# EAGLE design AFM_Power_board (EAGLE 9.6.2)
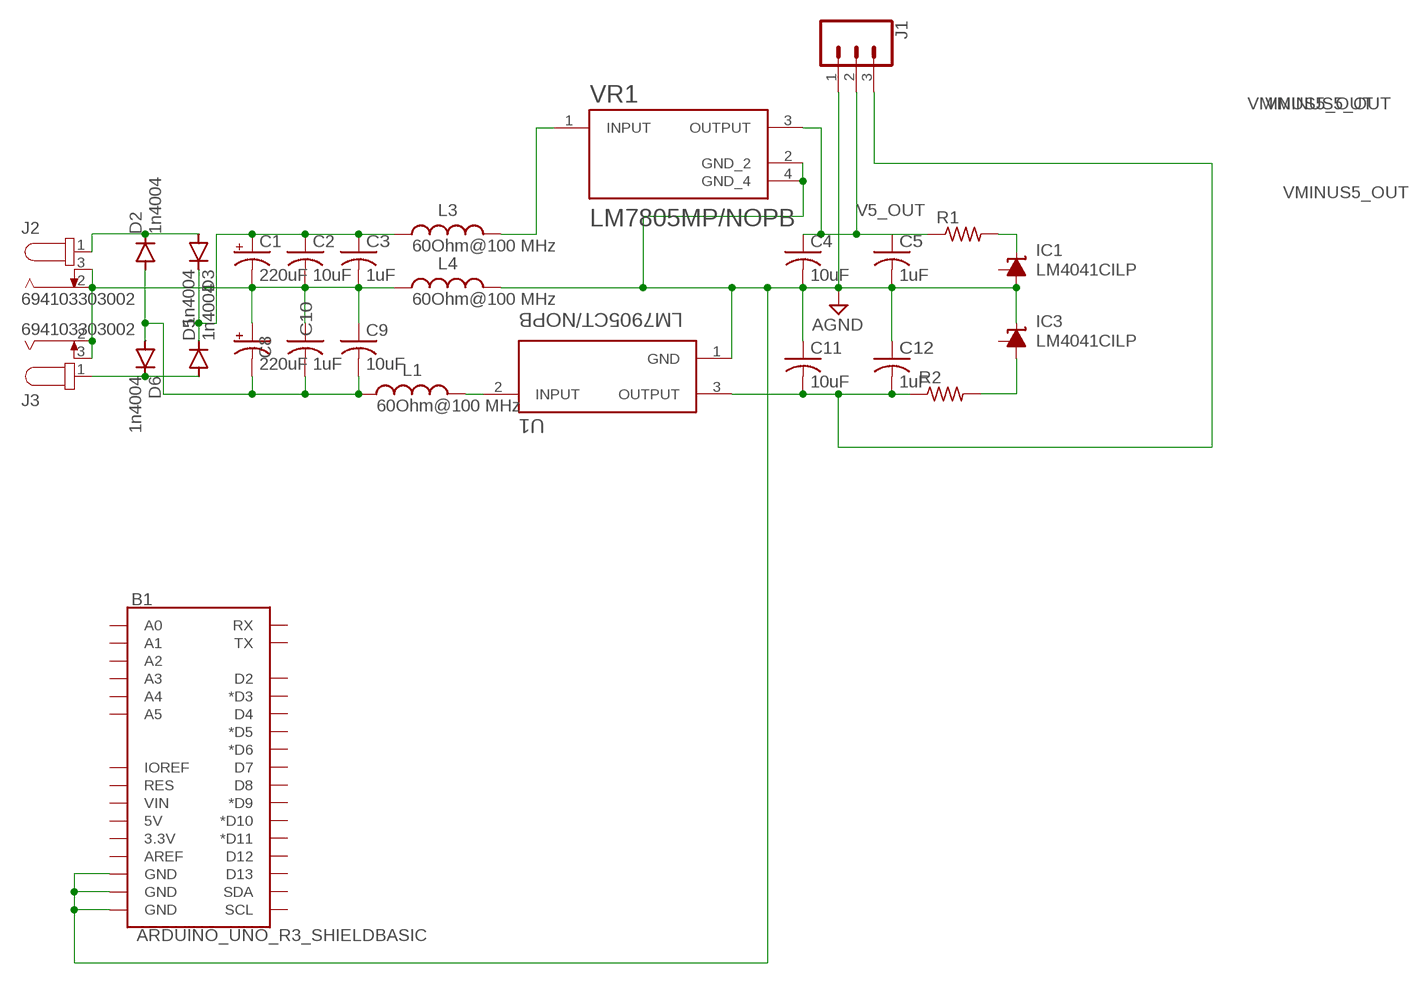
[diagram p0: schematic, sheet 1]

## Parts
B1  ARDUINO_UNO_R3_SHIELDBASIC  [UNO_R3_SHIELD]
C1  220uF  CAPACITOR-PE5-8.5  [E5-8,5]
C2  10uF  C-US050-024X044  [C050-024X044]
C3  1uF  C-US050-024X044  [C050-024X044]
C4  10uF  C-US050-024X044  [C050-024X044]
C5  1uF  C-US050-024X044  [C050-024X044]
C8  220uF  CAPACITOR-PE5-8.5  [E5-8,5]
C9  10uF  C-US050-024X044  [C050-024X044]
C10  1uF  C-US050-024X044  [C050-024X044]
C11  10uF  C-US050-024X044  [C050-024X044]
C12  1uF  C-US050-024X044  [C050-024X044]
D2  1n4004  DIODE-SOD123  [SOD123]
D3  1n4004  DIODE-SOD123  [SOD123]
D5  1n4004  DIODE-SOD123  [SOD123]
D6  1n4004  DIODE-SOD123  [SOD123]
IC1  LM4041CILP  [LP_O-PBCY-W3]
IC3  LM4041CILP  [LP_O-PBCY-W3]
J1  CONN_03LONGPADS  [1X03_LONGPADS]
J2  694103303002  [694103303002]
J3  694103303002  [694103303002]
L1  60Ohm@100 MHz  WE-CBF_0603_74279267_WB_HS  [WE-CBF_0603_W2.2]
L3  60Ohm@100 MHz  WE-CBF_0603_74279267_WB_HS  [WE-CBF_0603_W2.2]
L4  60Ohm@100 MHz  WE-CBF_0603_74279267_WB_HS  [WE-CBF_0603_W2.2]
R1  R-US_0204/5  [0204/5]
R2  R-US_0204/5  [0204/5]
U1  LM7905CT/NOPB  [TO254P1016X4575X1955-3]
VR1  LM7805MP/NOPB  [VREG_LM7805MP/NOPB]

## Nets
AGND: B1.GND@0(GND) B1.GND@1(GND) B1.GND@2(GND) C4.2 C5.2 C11.1 C12.1 IC1.3(A) IC3.2(C) J1.1 L4.2 U1.1(GND) VR1.2(GND_2) VR1.4(GND_4)
GROUND: C1.- C2.2 C3.2 C8.+ C9.1 C10.1 J2.2 J2.3 J3.2 J3.3 L4.1
N$1: L3.2 VR1.1(INPUT)
N$2: L1.2 U1.2(INPUT)
N$4: IC1.2(C) R1.2
N$8: IC3.3(A) R2.2
N$9: D5.A D6.C J3.1
N$10: C8.- C9.2 C10.2 D2.A D6.A L1.1
N$11: C1.+ C2.1 C3.1 D3.C D5.C L3.1
POWERP: D2.C D3.A J2.1
V5_OUT: C4.1 C5.1 J1.2 R1.1 VR1.3(OUTPUT)
VMINUS5_OUT: C11.2 C12.2 J1.3 R2.1 U1.3(OUTPUT)
Unconnected: B1.3.3V B1.5V B1.A0 B1.A1 B1.A2 B1.A3 B1.A4 B1.A5 B1.AREF B1.D2 B1.D3(*D3) B1.D4 B1.D5(*D5) B1.D6(*D6) B1.D7 B1.D8 B1.D9(*D9) B1.D10(*D10) B1.D11(*D11) B1.D12 B1.D13 B1.IOREF B1.RES B1.RX B1.SCL B1.SDA B1.TX B1.VIN IC1.1(FB) IC3.1(FB)

## Library data of the parts
B1 = SparkFun-Boards:ARDUINO_UNO_R3_SHIELD: Arduino R3 Shield Footprint Shield form compatible with the Arduino Uno R3. SparkFun Products: MG2639 Cellular Shield <https://www.sparkfun.com/products/13120> MIDI Shield <https://www.sparkfun.com/products/12898> R3 Stackable Headers Kit <https://www.sparkfun.com/products/11417>
C1 C8 = BeagleBone_Blue_R3:CAPACITOR-P: POLARIZED CAPACITOR, American symbol
C2-C5 C9-C12 = BeagleBone_Black_Wireless:C-US: CAPACITOR, American symbol
D2 D3 D5 D6 = diode:DIODE-: DIODE
IC1 IC3 = texas:LM4041*I: PRECISION MICROPOWER SHUNT VOLTAGE REFERENCE Adjustable Output Source: http://focus.ti.com/lit/ds/slcs146e/slcs146e.pdf; MPN: LM4041CILP; OC_FARNELL: 1673945; OC_NEWARK: 50M8856
J1 = SparkFun-Connectors:CONN_03: Multi connection point. Often used as Generic Header-pin footprint for 0.1 inch spaced/style header connections On any of the 0.1 inch spaced packages, you can populate with these: Break Away Headers - Straight <https://www.sparkfun.com/products/116> (PRT-00116) Break Away Male Headers - Right Angle <https://www.sparkfun.com/products/553> (PRT-00553) Female Headers <https://www.sparkfun.com/products/115> (PRT-00115) Break Away Headers - Machine Pin <https://www.sparkfun.com/products/117> (PRT-00117) Break Away Female Headers - Swiss Machine Pin <https://www.sparkfun.com/products/743> (PRT-00743) Stackable Header - 3 Pin (Female, 0.1") <https://www.sparkfun.com/products/13875> (PRT-13875) For SCREWTERMINALS and SPRING TERMINALS visit here: Screw Terimnals on SparkFun.com <https://www.sparkfun.com/search/results?term=Screw+Terminals> (5mm/3.5mm/2.54mm spacing) This device is also useful as a general connection point to wire up your design to another part of your project. Our various solder wires solder well into these plated through hole pads. Hook-Up Wire - Assortment (Stranded, 22 AWG) <https://www.sparkfun.com/products/11375> (PRT-11375) Hook-Up Wire - Assortment (Solid Core, 22 AWG) <https://www.sparkfun.com/products/11367> (PRT-11367) View the entire wire category on our website here <https://www.sparkfun.com/categories/141> Special notes: Molex polarized connector foot print use with SKU : PRT-08232 with associated crimp pins and housings.
J2 J3 = DC Power Jacks:694103303002: CONN PWR JACK 1.05X3.5MM SOLDER Manufacturer's datasheet <https://katalog.we-online.de/em/datasheet/6941xx303002.pdf>; CREATED_BY: PCBLayout.com; DIGIKEY_PART_NUMBER: 732-5925-ND; MANUFACTURER: Wurth Electronics Inc.; MPN: 694103303002
L1 L3 L4 = Wurth_EMC Components_WE-CBF:WE-CBF_0603: WE-CBF SMD EMI Suppression Ferrite Bead Characteristics Reliable Ni-Sn electrodes High rated current up to 6 A Operating temperature: –55 ºC to +125 ºC Applications Perfect as data lined filter and for uncoupling of distribution voltage Package name and Variant abbreviation: Package: Wide Band /High Speed: W=Width= 2.2 High Current: W=Width= 2.6 Variant abbreviation: WB = Wide Band HS=High Speed HC=High Current <https://www.we-online.com/catalog/media/o14753v209%20Family_WE-CBF.jpg> Details see: www.we-online.com/katalog/WE-CBF <www.we-online.com/catalog/WE-CBF/?utm_source=eagle_model&utm_medium=description_link&utm_campaign=eisos_eagle> Updated by Ella Wu 2022-11-02 2022(C) Wurth Elektronik; DATASHEET-URL: https://www.we-online.com/redexpert/spec/74279267?ae; IR2: 2000mA; MOUNT: SMT; PART-NUMBER: 74279267; RDC-MAX: 0.3Ohm; TYPE: High Speed; Z-MAX: 110Ohm@650 MHz
R1 R2 = BeagleBone_Black_Wireless:R-US_: RESISTOR, American symbol
U1 = LM7905CT_NOPB:LM7905CT/NOPB: Check availability <https://pricing.snapeda.com/parts/LM7905CT/NOPB/Texas%20Instruments/view-part?ref=eda>; AVAILABILITY: In Stock; CHECK_PRICES: https://www.snapeda.com/parts/LM7905CT/NOPB/Texas+Instruments/view-part/?ref=eda; DESCRIPTION: 1.5-A, negative linear voltage regulator; MF: Texas Instruments; MP: LM7905CT/NOPB; PACKAGE: TO-220-3 Texas Instruments; PRICE: None; PURCHASE-URL: https://www.snapeda.com/api/url_track_click_mouser/?unipart_id=6864&manufacturer=Texas Instruments&part_name=LM7905CT/NOPB&search_term=None; SNAPEDA_LINK: https://www.snapeda.com/parts/LM7905CT/NOPB/Texas+Instruments/view-part/?ref=snap
VR1 = LM7805MP_NOPB:LM7805MP/NOPB: 1.5-A, 30-V, linear voltage regulator 4-SOT-223 0 to 125 Check availability <https://pricing.snapeda.com/parts/LM7805MP/NOPB/Texas%20Instruments/view-part?ref=eda>; AVAILABILITY: In Stock; CHECK_PRICES: https://www.snapeda.com/parts/LM7805MP/NOPB/Texas+Instruments/view-part/?ref=eda; DESCRIPTION: 1.5-A, 30-V, linear voltage regulator; MF: Texas Instruments; MP: LM7805MP/NOPB; PACKAGE: SOT-223-4 Texas Instruments; PRICE: None; PURCHASE-URL: https://www.snapeda.com/api/url_track_click_mouser/?unipart_id=545076&manufacturer=Texas Instruments&part_name=LM7805MP/NOPB&search_term=lm7805; SNAPEDA_LINK: https://www.snapeda.com/parts/LM7805MP/NOPB/Texas+Instruments/view-part/?ref=snap

## Board
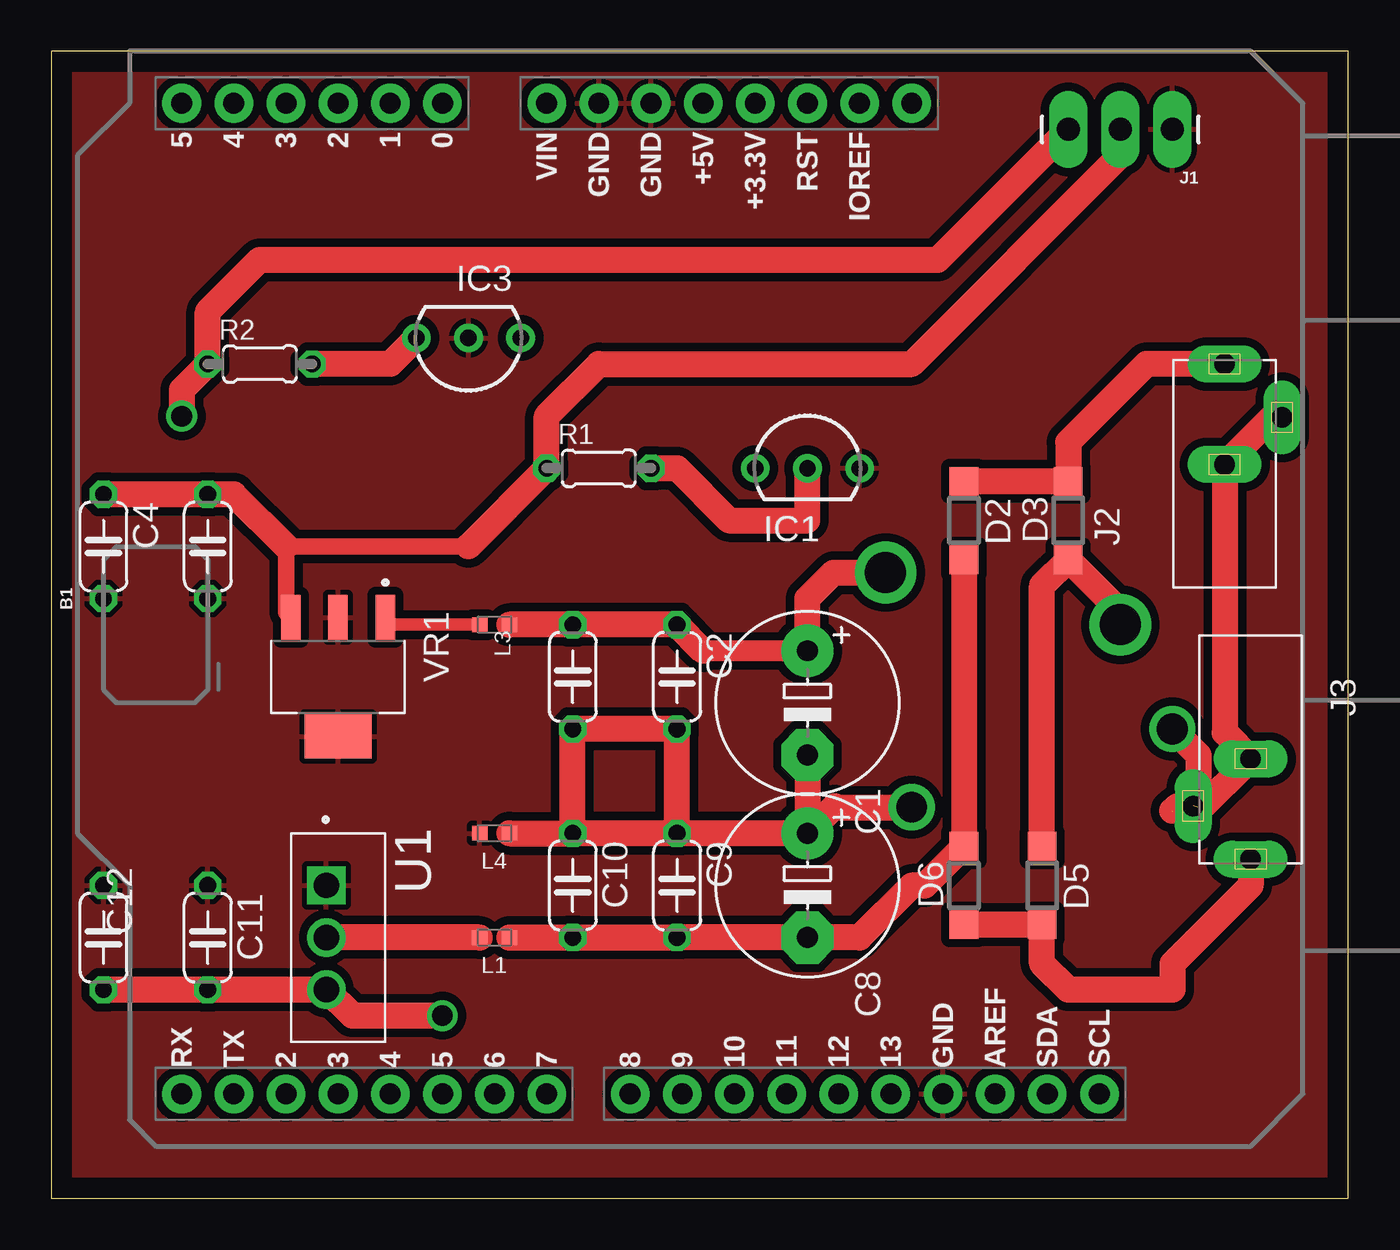
[diagram p1: board, top side]
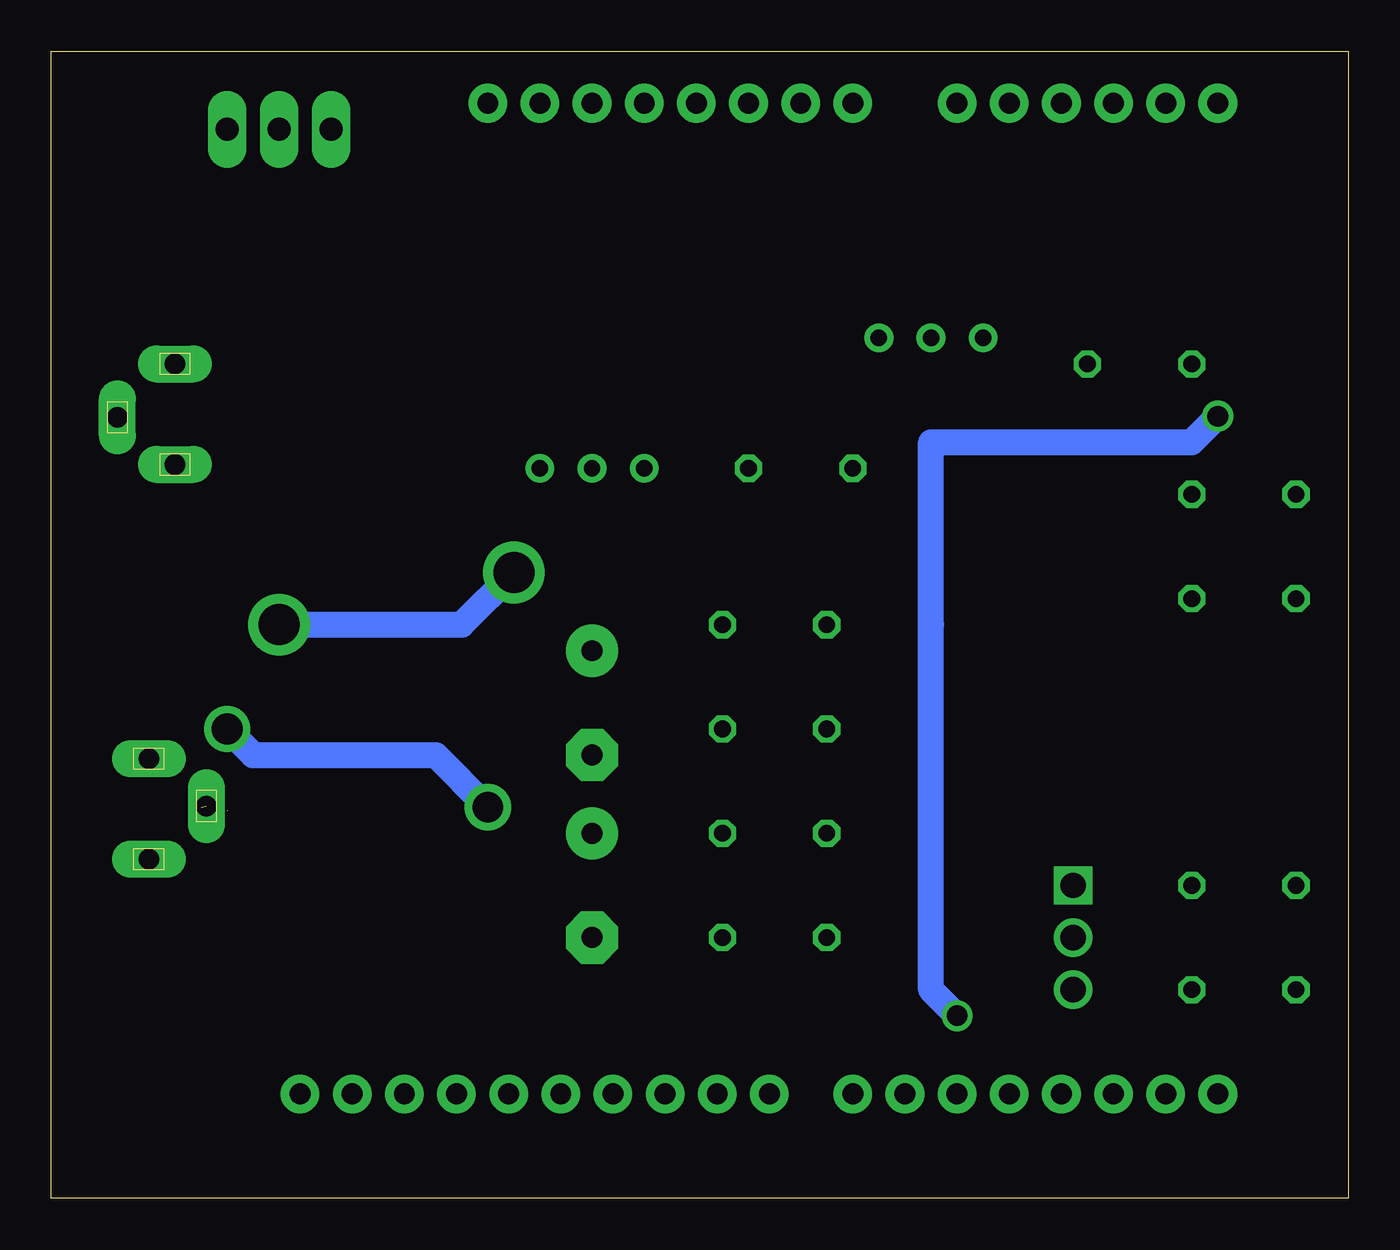
[diagram p2: board, bottom side, seen from below]

Size 63.17 x 55.87 mm. Coordinates in mm from the lower left corner, seen from the top.
Outline: 0,0 63.17,0 63.17,55.87 0,55.87 0,0
Copper layers (1*16): Top 0.035mm / dielectric 1.5mm / Bottom 0.035mm
Design rules "default": minimum track width 6mil, minimum drill 0.35mm, track to track 6mil, track to pad 6mil, pad to pad 6mil, via to via 6mil, smd to smd 6mil, copper to edge 40mil, drill to drill 6mil, minimum pad ring 10mil, minimum via ring 8mil, stop-mask expansion 4mil, vias tented up to drill 0mil, thermal gap 10mil

### Footprints (pad centres in the part's own frame; a part is rotated, then mirrored left to right if it is on the bottom)
UNO_R3_SHIELD = drill 1.016 pad 1.88: 3.3V 24.13,-2.54; 5V 24.13,0; A0 24.13,12.7; A1 24.13,15.24; A2 24.13,17.78; A3 24.13,20.32; A4 24.13,22.86; A5 24.13,25.4; AREF -24.13,-14.224; D2 -24.13,20.32; D3 -24.13,17.78; D4 -24.13,15.24; D5 -24.13,12.7; D6 -24.13,10.16; D7 -24.13,7.62; D8 -24.13,3.556; D9 -24.13,1.016; D10 -24.13,-1.524; D11 -24.13,-4.064; D12 -24.13,-6.604; D13 -24.13,-9.144; GND@0 24.13,2.54; GND@1 24.13,5.08; GND@2 -24.13,-11.684; IOREF 24.13,-7.62; NC 24.13,-10.16; RES 24.13,-5.08; RX -24.13,25.4; SCL -24.13,-19.304; SDA -24.13,-16.764; TX -24.13,22.86; VIN 24.13,7.62
E5-8,5 = drill 1.016 pad 2.54: + -2.54,0 | drill 1.016 pad 2.54 octagon: - 2.54,0
C050-024X044 = drill 0.813 octagon: 1 -2.54,0; 2 2.54,0
SOD123 = smd 1.4 x 1.4: A 1.9,0; C -1.9,0
LP_O-PBCY-W3 = drill 0.8 pad 1.4: 1 -2.54,0; 2 0,0; 3 2.54,0
1X03_LONGPADS = drill 1.118 pad 1.88 long: 1 0,0; 2 2.54,0; 3 5.08,0
694103303002 = drill 1 pad 1.8 long: 1 0,0; 2 -4.9,0; 3 -2.6,-2.8
WE-CBF_0603_W2.2 = smd 0.75 x 0.7: 1 -0.725,0; 2 0.725,0
0204/5 = drill 0.813 octagon: 1 -2.54,0; 2 2.54,0
TO254P1016X4575X1955-3 = drill 1.24 square: 1 -2.54,-0.573 | drill 1.24: 2 0,-0.573; 3 2.54,-0.573
VREG_LM7805MP/NOPB = smd 2.15 x 0.95: 1 -2.9,2.3; 2 -2.9,0; 3 -2.9,-2.3 | smd 2.15 x 3.25: 4 2.9,0

### Placement (x,y rotation side)
B1  31.75,29.21 90 top
C1  36.83,24.13 270 top
C2  30.48,25.4 270 top
C3  25.4,25.4 270 top
C4  2.54,31.75 270 top
C5  7.62,31.75 270 top
C8  36.83,15.24 270 top
C9  30.48,15.24 270 top
C10  25.4,15.24 270 top
C11  7.62,12.7 270 top
C12  2.54,12.7 270 top
D2  44.45,33.02 270 top
D3  49.53,33.02 90 top
D5  48.26,15.24 270 top
D6  44.45,15.24 90 top
IC1  36.83,35.56 0 top
IC3  20.32,41.91 180 top
J1  54.61,52.07 180 top
J2  57.15,40.64 90 top
J3  58.42,16.51 270 top
L1  21.59,12.7 180 top
L3  21.59,27.94 180 top
L4  21.59,17.78 180 top
R1  26.67,35.56 0 top
R2  10.16,40.64 0 top
U1  13.97,12.7 270 top
VR1  13.97,25.4 270 top

### Tracks (layer width: path | path; a pad name or v marks a point on that pad's centre or on a via)
AGND
  pour Top (isolate 0.406, rank 6): 0,55.88 63.5,55.88 63.5,0 0,0
GROUND  (via drill 1.5)  (2 unrouted)
  Top 1.27: J2.3 59.45,38.04 J2.2 57.15,22.68 J3.2 55.88,18.87 54.59,18.87 | J3.3 54.85,19.11 54.61,18.87 | C1.- C8.+ | C8.+ C10.1 | C10.1 C3.2 C2.2 C9.1 | C8.+ 38.16,19.11 | C8.+ 38.1,19.05 v41.91,19.05 | v54.61,22.86 55.88,21.59 55.88,19.05 | L4.1 C10.1
  Bottom 1.27: v54.61,22.86 53.34,21.59 44.45,21.59 v41.91,19.05
N$1
  Top 0.61: VR1.1 16.63,27.94 L3.2
N$2
  Top 1.27: L1.2 U1.2
N$4
  Top 1.27: R1.2 30.48,35.56 33.02,33.02 36.83,33.02 IC1.2
N$8
  Top 1.27: IC3.3 16.51,40.64 R2.2
N$9
  Top 1.27: J3.1 58.42,15.24 54.61,11.43 54.61,10.16 49.53,10.16 48.26,11.43 D5.A D6.C
N$10
  Top 1.27: L1.1 C10.2 C9.2 C8.- 39.37,12.7 41.91,15.24 42.55,15.24 D6.A D2.A
N$11  (via drill 2)
  Top 1.016: C1.+ 31.75,26.67
  Top 1.27: C1.+ 36.83,29.21 38.1,30.48 v40.64,30.48 | 31.75,26.67 C2.1 C3.1 L3.1 | D5.C 48.26,29.85 D3.C 52.07,28.58 v52.07,27.94
  Bottom 1.27: v52.07,27.94 43.18,27.94 v40.64,30.48
POWERP
  Top 1.27: J2.1 53.34,40.64 49.53,36.83 D3.A D2.C
V5_OUT
  Top 0.813: VR1.3 11.43,28.54 11.43,31.75 20.32,31.75
  Top 1.27: 11.43,31.75 8.89,34.29 C5.1 C4.1 | 20.32,31.75 R1.1 24.13,38.1 26.67,40.64 41.91,40.64 52.07,50.8 J1.2
VMINUS5_OUT  (via drill 1)
  Top 1.27: v6.35,38.1 6.35,39.37 R2.1 7.62,43.18 10.16,45.72 43.18,45.72 J1.3 | v19.05,8.89 14.67,8.89 U1.3 C12.2 C11.2
  Bottom 1.27: v19.05,8.89 20.32,10.16 20.32,27.94 20.32,36.83 7.62,36.83 v6.35,38.1